# Altium project Q24_ECU_REWORK.PrjPcb (part 1 of 2)
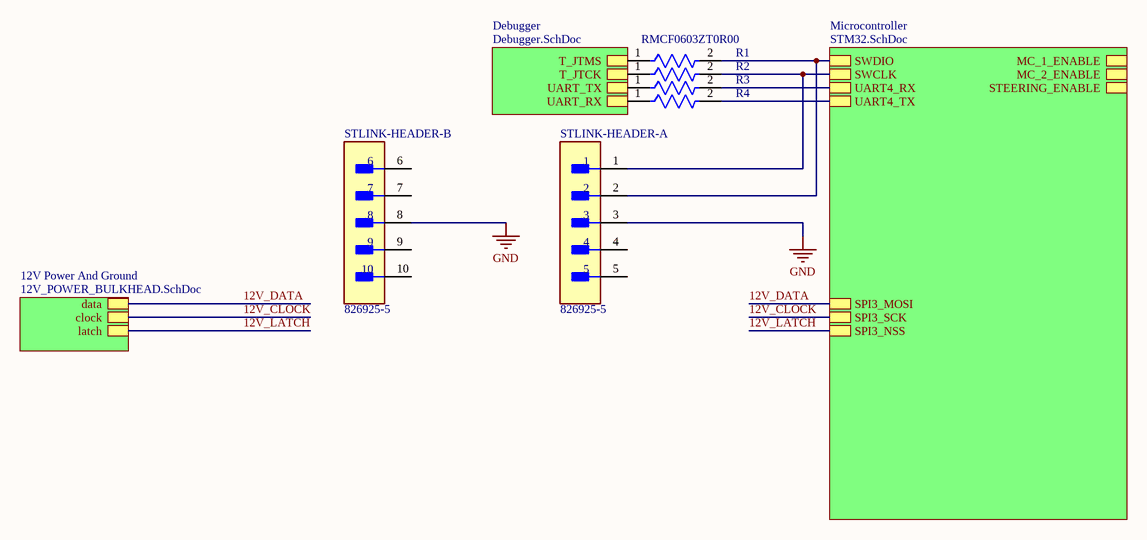
[diagram p0: TOP.SchDoc]
19 sheets, 138 parts. Net scope: hierarchical (ports join the sheet entries above them; power ports are global).
Board file: PCB.PcbDoc
Sheets:
  TOP.SchDoc
    Microcontroller = STM32.SchDoc
      12_TO_3_VOLTAGE_DIVIDER = 12_TO_3V3_VOLTAGE_DIVIDER.SchDoc
      12_TO_3_VOLTAGE_DIVIDER = 12_TO_3V3_VOLTAGE_DIVIDER.SchDoc
      12_TO_3_VOLTAGE_DIVIDER = 12_TO_3V3_VOLTAGE_DIVIDER.SchDoc
      12_TO_3_VOLTAGE_DIVIDER = 12_TO_3V3_VOLTAGE_DIVIDER.SchDoc
      12_TO_3_VOLTAGE_DIVIDER = 12_TO_3V3_VOLTAGE_DIVIDER.SchDoc
      12_TO_3_VOLTAGE_DIVIDER = 12_TO_3V3_VOLTAGE_DIVIDER.SchDoc
    Debugger = Debugger.SchDoc
      MCU = DebuggerMCU.SchDoc
      POWER = Power.SchDoc
      CONNECTORS = DebuggerConnectors.SchDoc
    12V Power And Ground = 12V_POWER_BULKHEAD.SchDoc
      Shift Register = shiftRegister.SchDoc
      Designator = 12V_LS.SchDoc
      Designator = 12V_LS.SchDoc
      Designator = 12V_LS.SchDoc
      Designator = 12V_LS.SchDoc
      Designator = 12V_LS.SchDoc
      Designator = 12V_LS.SchDoc
  Connectors.SchDoc
    Buck = Buck.SchDoc
    LDO = LDO.SchDoc
  CAN.SchDoc
  IMU.SchDoc
  5VBulkhead.SchDoc
    Shift Register = shiftRegister.SchDoc
    5VLS1 = 5V_LS.SchDoc
    5VLS2 = 5V_LS.SchDoc
    5VLS3 = 5V_LS.SchDoc
    5VLS4 = 5V_LS.SchDoc
    5VLS5 = 5V_LS.SchDoc
    5VLS6 = 5V_LS.SchDoc
  5V_TO_3V3_VOLTAGE_DIVIDER.SchDoc
  BOARD_POWER.SchDoc

## Sheet TOP.SchDoc: =DocumentName
size A4; Organization: Queen's Formula SAE; Address1: 130 Stuart St, Kingston; Address2: Ontario; Address3: Canada; Address4: K7L 2V9; DocumentNumber: 1; Revision: 0; SheetNumber: 1; SheetTotal: 1

### Parts
R1  RMCF0603ZT0R00  [FP-RMCF0603-MFG]
R2  RMCF0603ZT0R00  [FP-RMCF0603-MFG]  (value not drawn)
R3  RMCF0603ZT0R00  [FP-RMCF0603-MFG]  (value not drawn)
R4  RMCF0603ZT0R00  [FP-RMCF0603-MFG]  (value not drawn)
STLINK-HEADER-  826925-5  [FP-826925-5-MFG]  (parts A,B of 2)

### Sub-sheets
12V Power And Ground = 12V_POWER_BULKHEAD.SchDoc: data, clock, latch
Debugger = Debugger.SchDoc: T_JTCK, T_JTMS, UART_TX, UART_RX
Microcontroller = STM32.SchDoc: SWDIO, SWCLK, UART4_RX, UART4_TX, SPI3_NSS, SPI3_MOSI, SPI3_SCK, MC_1_ENABLE, MC_2_ENABLE, STEERING_ENABLE

### Nets
GND: STLINK-HEADER-.3 STLINK-HEADER-.8
12V_CLOCK: sheet Microcontroller/SPI3_SCK, sheet 12V Power And Ground/clock
12V_DATA: sheet Microcontroller/SPI3_MOSI, sheet 12V Power And Ground/data
12V_LATCH: sheet Microcontroller/SPI3_NSS, sheet 12V Power And Ground/latch
T_JTCK: R2.1 ; sheet Debugger/T_JTCK
T_JTMS: R1.1 ; sheet Debugger/T_JTMS
UART_RX: R4.1 ; sheet Debugger/UART_RX
UART_TX: R3.1 ; sheet Debugger/UART_TX
NetR1_2: R1.2 STLINK-HEADER-.2 ; sheet Microcontroller/SWDIO
NetR2_2: R2.2 STLINK-HEADER-.1 ; sheet Microcontroller/SWCLK
NetR3_2: R3.2 ; sheet Microcontroller/UART4_RX
NetR4_2: R4.2 ; sheet Microcontroller/UART4_TX

Not connected (* = marked no-connect by the designer): STLINK-HEADER- 4 5 6 7 9 10

### Notes on the sheet
- Title
- Size:
- Date:
- A4
- Number:
- Time:
- Revision:
- Sheet
- of
- File:

### Library data of the parts
R1-R4 = CMP-26527-000011-1: RES 0 OHM JUMPER 1/10W 0603; Manufacturer: Stackpole; Power Rating: 0.1W; Voltage Rating: 75V; Resistance: 0mΩ; Automotive Grade: Grade 0; Value: 0mΩ; Series: RMCF; Manufacturer Part Number: RMCF0603ZT0R00; Device Class L1: Passive Components; Device Class L3: Chip SMD Resistors; Octopart: https://octopart.com/rmcf0603zt0r00-stackpole+electronics-19213618; Temperature: -55°C to +155°C; Lead Free: Yes; ComponentLink2URL: https://www.seielect.com/catalog/sei-rmcf_rmcp.pdf; Height: 0.55mm; Composition: Thick Film; Package: RMCF0603; Automotive: Yes; Temperature Range High: +155°C; Ipc Land Pattern Name: RESC15580X45; Digikey Description: RES 0 OHM JUMPER 1/10W 0603; RoHS: TRUE; ComponentLink2Description: Datasheet; Temperature Range Low: -55°C; Category: Res; Device Class L2: Resistors
STLINK-HEADER- = CMP-03369-000006-1: CONN HEADER VERT 10POS 2.54MM; Manufacturer: TE Connectivity; Conn Orientation: Vertical; Standoff Height: 0.3mm; Number Of Contacts: 10; Current Rating: 5A; Conn Gender: Male; Number Of Rows: 2; Category: Conn; Octopart: https://octopart.com/826925-5-te+connectivity-41836231; Lead Free: Yes; Height: 9.9mm; ComponentLink2Description: Datasheet; Temperature Range High: +105°C; Pitch: 2.54mm; Manufacturer Part Number: 826925-5; Automotive: No; Digikey Description: CONN HEADER VERT 10POS 2.54MM; ComponentLink2URL: https://www.te.com/commerce/DocumentDelivery/DDEController?Action=showdoc&DocId=Customer+Drawing%7F826629%7FAC%7Fpdf%7FEnglish%7FENG_CD_826629_AC.pdf%7F826925-5; Temperature: -65°C to +105°C; RoHS: TRUE; Package: 826925-5; Contact Material: Tin,Nickel; Mouser Description: Headers & Wire Housings 2X05 POS VERT TIN; Device Class L2: Headers and Wire Housings; Device Class L3: unset; Device Class L1: Connectors; Temperature Range Low: -65°C

## Sheet STM32.SchDoc
size A4
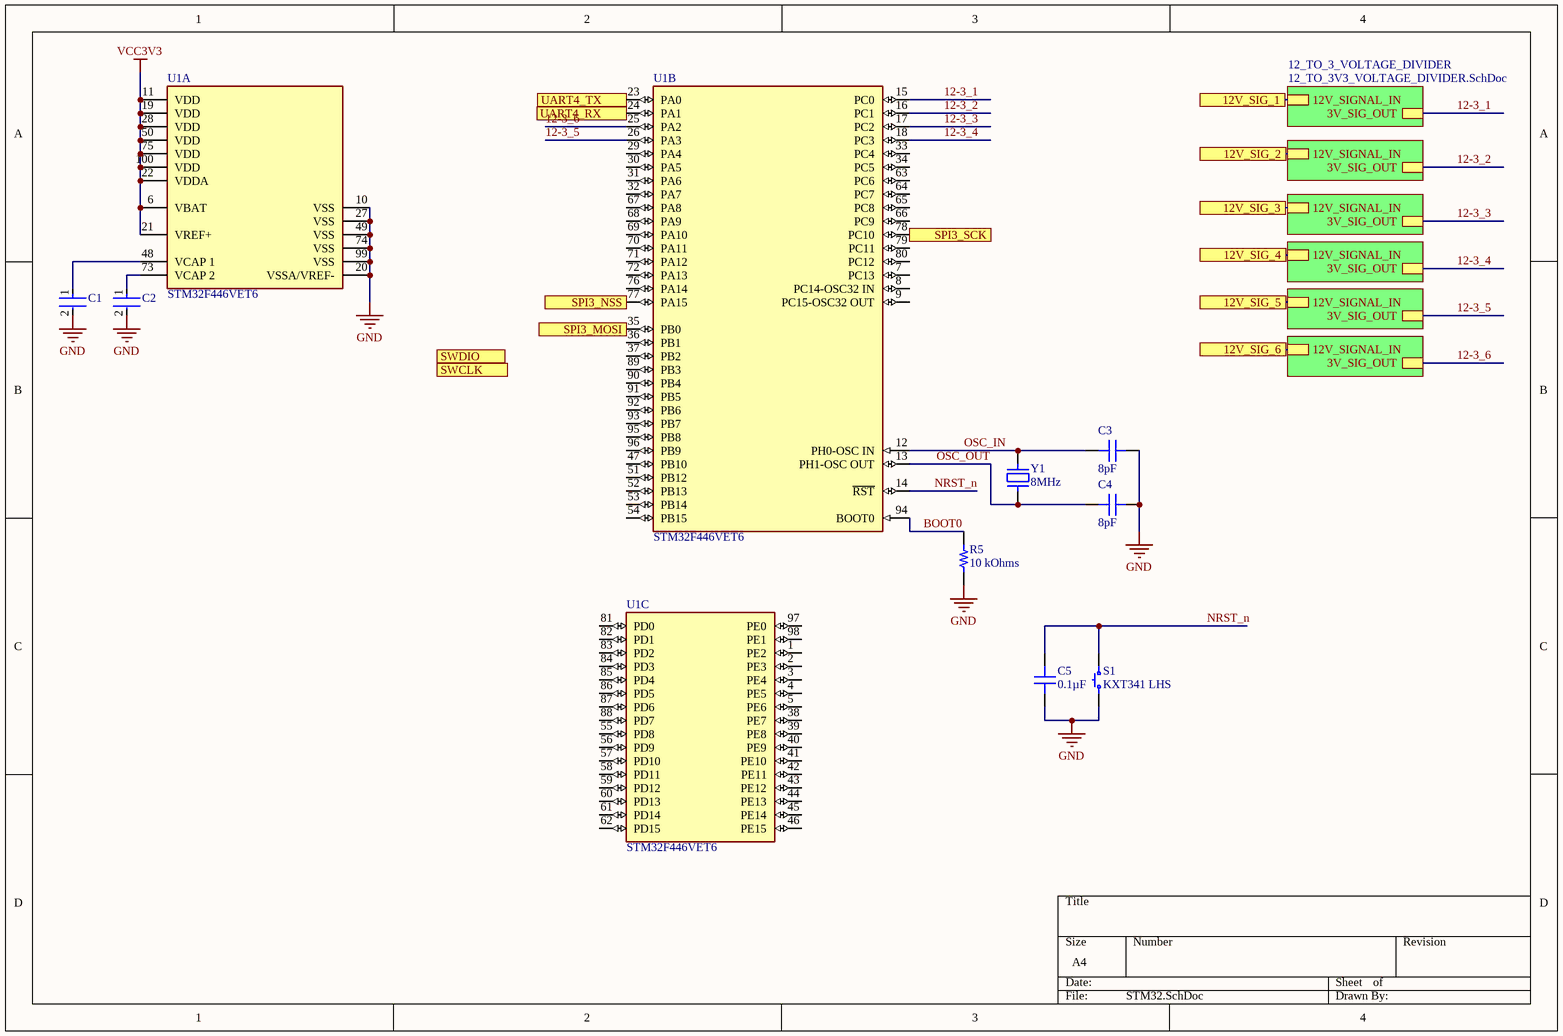
[diagram p1: STM32.SchDoc]

### Parts
C1  GRM188R71A225KE15D  [FP-GRM188-0_1-e0_2_0_5-MFG]  (value not drawn)
C2  GRM188R71A225KE15D  [FP-GRM188-0_1-e0_2_0_5-MFG]  (value not drawn)
C3  8pF  [CAP 0402_1005]
C4  8pF  [CAP 0402_1005]
C5  0.1µF  [CAP 0402_1005]
R5  10 kOhms  [RES 0402_1005]
S1  KXT341 LHS  [C&K KXT3]
U1  STM32F446VET6  [FP-LQFP100-1L-MFG]  (parts A,B,C of 3)
Y1  8MHz  [NDK NX3225GD]

### Sub-sheets
12_TO_3_VOLTAGE_DIVIDER = 12_TO_3V3_VOLTAGE_DIVIDER.SchDoc: 12V_SIGNAL_IN, 3V_SIG_OUT
12_TO_3_VOLTAGE_DIVIDER = 12_TO_3V3_VOLTAGE_DIVIDER.SchDoc: 12V_SIGNAL_IN, 3V_SIG_OUT
12_TO_3_VOLTAGE_DIVIDER = 12_TO_3V3_VOLTAGE_DIVIDER.SchDoc: 12V_SIGNAL_IN, 3V_SIG_OUT
12_TO_3_VOLTAGE_DIVIDER = 12_TO_3V3_VOLTAGE_DIVIDER.SchDoc: 12V_SIGNAL_IN, 3V_SIG_OUT
12_TO_3_VOLTAGE_DIVIDER = 12_TO_3V3_VOLTAGE_DIVIDER.SchDoc: 12V_SIGNAL_IN, 3V_SIG_OUT
12_TO_3_VOLTAGE_DIVIDER = 12_TO_3V3_VOLTAGE_DIVIDER.SchDoc: 12V_SIGNAL_IN, 3V_SIG_OUT

### Ports
12V_SIG_1, 12V_SIG_2, 12V_SIG_3, 12V_SIG_4, 12V_SIG_5, 12V_SIG_6, SPI3_MOSI, SPI3_NSS, SPI3_SCK, SWCLK, SWDIO, UART4_RX, UART4_TX

### Nets
GND: C1.2 C2.2 C3.2 C4.2 C5.1 R5.1 S1.1 U1.10(VSS) U1.20(VSSA/VREF-) U1.27(VSS) U1.49(VSS) U1.74(VSS) U1.99(VSS)
VCC3V3: U1.6(VBAT) U1.11(VDD) U1.19(VDD) U1.21(VREF+) U1.22(VDDA) U1.28(VDD) U1.50(VDD) U1.75(VDD) U1.100(VDD)
12-3_1: U1.15(PC0) ; sheet 12_TO_3_VOLTAGE_DIVIDER/3V_SIG_OUT
12-3_2: U1.16(PC1) ; sheet 12_TO_3_VOLTAGE_DIVIDER/3V_SIG_OUT
12-3_3: U1.17(PC2) ; sheet 12_TO_3_VOLTAGE_DIVIDER/3V_SIG_OUT
12-3_4: U1.18(PC3) ; sheet 12_TO_3_VOLTAGE_DIVIDER/3V_SIG_OUT
12-3_5: U1.26(PA3) ; sheet 12_TO_3_VOLTAGE_DIVIDER/3V_SIG_OUT
12-3_6: U1.25(PA2) ; sheet 12_TO_3_VOLTAGE_DIVIDER/3V_SIG_OUT
12V_CLOCK: U1.78(PC10) ; port SPI3_SCK
12V_DATA: U1.35(PB0) ; port SPI3_MOSI
12V_LATCH: U1.77(PA15) ; port SPI3_NSS
BOOT0: R5.2 U1.94(BOOT0)
NRST_n: C5.2 S1.2 U1.14(~{RST})
OSC_IN: C3.1 U1.12(PH0-OSC_IN) Y1.2
OSC_OUT: C4.1 U1.13(PH1-OSC_OUT) Y1.1
NetC1_1: C1.1 U1.48(VCAP_1)
NetC2_1: C2.1 U1.73(VCAP_2)
NetR3_2: U1.24(PA1) ; port UART4_RX
NetR4_2: U1.23(PA0) ; port UART4_TX
NetR24_Microcontroller_12_TO_3_VOLTAGE_DIVIDER#1_2: port 12V_SIG_1, sheet 12_TO_3_VOLTAGE_DIVIDER/12V_SIGNAL_IN
NetR24_Microcontroller_12_TO_3_VOLTAGE_DIVIDER#2_2: port 12V_SIG_2, sheet 12_TO_3_VOLTAGE_DIVIDER/12V_SIGNAL_IN
NetR24_Microcontroller_12_TO_3_VOLTAGE_DIVIDER#3_2: port 12V_SIG_3, sheet 12_TO_3_VOLTAGE_DIVIDER/12V_SIGNAL_IN
NetR24_Microcontroller_12_TO_3_VOLTAGE_DIVIDER#4_2: port 12V_SIG_4, sheet 12_TO_3_VOLTAGE_DIVIDER/12V_SIGNAL_IN
NetR24_Microcontroller_12_TO_3_VOLTAGE_DIVIDER#5_2: port 12V_SIG_5, sheet 12_TO_3_VOLTAGE_DIVIDER/12V_SIGNAL_IN
NetR24_Microcontroller_12_TO_3_VOLTAGE_DIVIDER#6_2: port 12V_SIG_6, sheet 12_TO_3_VOLTAGE_DIVIDER/12V_SIGNAL_IN

Not connected (* = marked no-connect by the designer): U1 1(PE2) 2(PE3) 3(PE4) 4(PE5) 5(PE6) 7(PC13) 8(PC14-OSC32_IN) 9(PC15-OSC32_OUT) 29(PA4) 30(PA5) 31(PA6) 32(PA7) 33(PC4) 34(PC5) 36(PB1) 37(PB2) 38(PE7) 39(PE8) 40(PE9) 41(PE10) 42(PE11) 43(PE12) 44(PE13) 45(PE14) 46(PE15) 47(PB10) 51(PB12) 52(PB13) 53(PB14) 54(PB15) 55(PD8) 56(PD9) 57(PD10) 58(PD11) 59(PD12) 60(PD13) 61(PD14) 62(PD15) 63(PC6) 64(PC7) 65(PC8) 66(PC9) 67(PA8) 68(PA9) 69(PA10) 70(PA11) 71(PA12) 72(PA13) 76(PA14) 79(PC11) 80(PC12) 81(PD0) 82(PD1) 83(PD2) 84(PD3) 85(PD4) 86(PD5) 87(PD6) 88(PD7) 89(PB3) 90(PB4) 91(PB5) 92(PB6) 93(PB7) 95(PB8) 96(PB9) 97(PE0) 98(PE1)

### Library data of the parts
C1 C2 = CMP-2006-02836-2: Chip Multilayer Ceramic Capacitors for General Purpose, 0603, 2.2uF, X7R, 15%, 10%, 10V; Case Code (Metric): 1608; Height: 0.8mm; Packaging: Cut Tape; Voltage: 10V; Lead Free: Lead Free; Min Operating Temperature: -55°C; Voltage Rating (DC): 10V; Max Operating Temperature: 125°C; Voltage Rating: 10V; Dielectric: X7R; Depth: 0.8mm; Case Code (Imperial): 0603; Termination: SMD/SMT; Case/Package: 0603; Number of Pins: 2; REACH SVHC: No SVHC; Mount: Surface Mount; Width: 0.031inch; Material: Ceramic; Capacitance: 2.2uF; Package Quantity: 1; Weight: 7.1E-05oz; Length: 1.6mm; Thickness: 0.035inch; Tolerance: 10%
C3 C4 = C1005NP01H080D050BA: CAP CER 8PF 50V NP0 0402; Manufacturer: TDK Corporation; Temperature Coefficient: C0G, NP0; Tolerance: ±0.5pF; Part Number: C1005NP01H080D050BA; Value: 8pF; Applications: General Purpose; Capacitance: 8pF; ComponentLink1Description: Datasheet; ComponentLink1URL: https://product.tdk.com/info/en/catalog/datasheets/mlcc_commercial_hightemp_en.pdf?ref_disty=digikey; ComponentLink2Description: DigiKey Link; ComponentLink2URL: http://digikey.com/product-detail/en/tdk-corporation/C1005NP01H080D050BA/445-13781-1-ND/3955447; Device Package: 0402 (1005 Metric); Features: High Temperature; LastUpdated: 2020-09-02 1:02:24 AM; Lifecycle Status: Active; Minimum Order: 1; Mounting Type: Surface Mount, MLCC; Operating Temperature: -55°C ~ 150°C; Package / Case: 0402 (1005 Metric); Packaging: TapeAndReel; PartId: 2033; Part Status: Active; Price: 0.01; Series: C; Size / Dimension: 0.039" L x 0.020" W (1.00mm x 0.50mm); Supplier 1: DigiKey; Supplier Part Number 1: 445-13781-1-ND; Thickness (Max): 0.022" (0.55mm); Voltage - Rated: 50V
C5 = C0402C104K4RECAUTO: CAP CER 0402 0.1UF 16V X7R 10%; Manufacturer: KEMET; Part Number: C0402C104K4RECAUTO; Value: 0.1µF; Applications: Automotive, ESD Protection; Capacitance: 0.1µF; ComponentLink1Description: Datasheet; ComponentLink1URL: https://api.kemet.com/component-edge/download/datasheet/C0402C104K4RECAUTO.pdf; ComponentLink2Description: DigiKey Link; ComponentLink2URL: http://digikey.com/product-detail/en/kemet/C0402C104K4RECAUTO/399-17167-1-ND/8563708; Device Package: 0402 (1005 Metric); LastUpdated: 2020-09-02 1:02:25 AM; Lifecycle Status: Active; Minimum Order: 1; Mounting Type: Surface Mount, MLCC; Operating Temperature: -55°C ~ 125°C; Package / Case: 0402 (1005 Metric); Packaging: TapeAndReel; PartId: 1731; Part Status: Active; Price: 0.02; Series: ESD SMD Auto X7R; Size / Dimension: 0.039" L x 0.020" W (1.00mm x 0.50mm); Supplier 1: DigiKey; Supplier Part Number 1: 399-17167-1-ND; Temperature Coefficient: X7R; Thickness (Max): 0.022" (0.55mm); Tolerance: ±10%; Voltage - Rated: 16V; Ratings: AEC-Q200
R5 = CRCW040210K0DHEDP: RES SMD 10K OHM 0.5% 1/16W 0402; Manufacturer: Vishay Dale; Power (Watts): 0.063W, 1/16W; Temperature Coefficient: ±50ppm/°C; Part Number: CRCW040210K0DHEDP; Value: 10 kOhms; ComponentLink1Description: Datasheet; ComponentLink1URL: http://www.vishay.com/docs/20036/dcrcwpe3.pdf; ComponentLink2Description: DigiKey Link; ComponentLink2URL: http://digikey.com/product-detail/en/vishay-dale/CRCW040210K0DHEDP/541-10KAVCT-ND/3593906; Composition: Thick Film; Device Package: 0402 (1005 Metric); Height - Seated (Max): 0.016" (0.40mm); LastUpdated: 2020-09-02 1:08:05 AM; Lifecycle Status: Active; Minimum Order: 1; Number of Terminations: 2; Operating Temperature: -55°C ~ 155°C; Package / Case: 0402 (1005 Metric); Packaging: TapeAndReel; PartId: 5057; Part Status: Active; Price: 0.03; Resistance: 10 kOhms; Series: CRCW-P; Size / Dimension: 0.039" L x 0.020" W (1.00mm x 0.50mm); Supplier 1: DigiKey; Supplier Part Number 1: 541-10KAVCT-ND; Supplier Device Package: 0402; Tolerance: ±0.5%; Features: Automotive AEC-Q200; Ratings: AEC-Q200
S1 = KXT341 LHS: SWITCH TACTILE SPST-NO 0.02A 15V; Manufacturer: C&K; Actuator Height off PCB, Vertical: 0.60mm; Actuator Orientation: Top Actuated; Actuator Type: Standard; Contact Rating @ Voltage: 0.02A @ 15VDC; Illumination: Non-Illuminated; Operating Force: 330gf; Outline: 3.00mm x 2.00mm; Switch Function: Off-Mom; Part Number: KXT341 LHS; Circuit: SPST-NO; ComponentLink1Description: Datasheet; ComponentLink1URL: https://dznh3ojzb2azq.cloudfront.net/products/Tactile/KXT3/documents/datasheet.pdf; ComponentLink2Description: DigiKey Link; ComponentLink2URL: http://digikey.com/product-detail/en/c-k/KXT341-LHS/CKN10781CT-ND/6607324; LastUpdated: 2020-09-02 1:27:07 AM; Lifecycle Status: Active; Minimum Order: 1; Mounting Type: Surface Mount; Operating Temperature: -40°C ~ 85°C; Packaging: TapeAndReel; Part Status: Active; Price: 0.14; Series: KXT3; Supplier 1: DigiKey; Supplier Part Number 1: CKN10781CT-ND; Termination Style: SMD (SMT) Tab
U1 = CMP-12105-000075-1: IC MCU 32BIT 512KB FLASH 100LQFP; Manufacturer: STMicroelectronics; Ram Size: 128KBytes; Data Bus Width: 32bits; Max Junction Temp: +125°C; Number Of Adc Channels: 16; Max Supply Voltage: 3.6V; Nominal Supply Current: 1.4-86mA; Number Of Uart Channels: 6; Core Architecture: ARM Cortex-M4; Standoff Height: 0.05mm; Number Of A/D Converters: 3; Frequency: 180MHz; Number Of Cores: 1; Min Supply Voltage: 1.65V; Number Of Timers/Counters: 14; Number Of Usb Channels: 2; Number Of Spi Channels: 4; Interface: I2C,SPI,UART,USART,Parallel,CAN,USB,LIN,IrDA,I2S,Other; Memory Size: 512KBytes; Number Of I/Os: 81; Ambient Temperature Range High: +85°C; Mouser Description: ARM Microcontrollers - MCU High-performance and DSP with FPU, ARM Cortex-M4 MCU with 512 Kbytes Flash, 180 MHz CPU, Art Accelerator, SDRAM; Device Class L2: Embedded Processors and Controllers; Temperature Range Low: -40°C; Device Class L1: Integrated Circuits (ICs); RoHS: TRUE; Ipc Land Pattern Name: QFP50P1600X1600X160-100; Manufacturer Part Number: STM32F446VET6; Octopart: https://octopart.com/stm32f446vet6-stmicroelectronics-52642922; Package: LQFP100-1L; Automotive: No; Category: IC; ComponentLink2URL: https://www.st.com/resource/en/datasheet/stm32f446ve.pdf; Digikey Description: IC MCU 32BIT 512KB FLASH 100LQFP; Temperature Range High: +85°C; Memory Type: FLASH; Lead Free: Yes; Height: 1.6mm; ComponentLink2Description: Datasheet; Number Of I2C Channels: 4; Device Class L3: Microcontrollers; Temperature: -40°C to +85°C; Ambient Temperature Range Low: -40°C
Y1 = NX3225GD-8MHZ-STD-CRA-3: CRYSTAL 8.0000MHZ 8PF SMD; Manufacturer: NDK America, Inc.; ESR (Equivalent Series Resistance): 500 Ohms; Frequency Stability: ±150ppm; Frequency Tolerance: ±50ppm; Operating Mode: Fundamental; Part Number: NX3225GD-8MHZ-STD-CRA-3; ComponentLink1Description: Datasheet; ComponentLink1URL: http://www.ndk.com/images/products/catalog/c_NX3225GD-STD-CRA-3_e.pdf; ComponentLink2Description: DigiKey Link; ComponentLink2URL: http://digikey.com/product-detail/en/ndk-america-inc/NX3225GD-8MHZ-STD-CRA-3/644-1178-1-ND/3125567; Frequency: 8MHz; Height - Seated (Max): 0.039" (1.00mm); LastUpdated: 2020-09-02 1:25:56 AM; Lifecycle Status: Active; Load Capacitance: 8pF; Minimum Order: 1; Mounting Type: Surface Mount; Operating Temperature: -40°C ~ 150°C; Package / Case: 2-SMD, No Lead; Packaging: TapeAndReel; PartId: 744; Part Status: Active; Price: 0.48; Ratings: AEC-Q200; Series: NX3225GD; Size / Dimension: 0.126" L x 0.098" W (3.20mm x 2.50mm); Supplier 1: DigiKey; Supplier Part Number 1: 644-1178-1-ND; Type: MHz Crystal; Value: 8MHz

## Sheet 12_TO_3V3_VOLTAGE_DIVIDER.SchDoc
size A4
Used 6 times, as channels Microcontroller/12_TO_3_VOLTAGE_DIVIDER, Microcontroller/12_TO_3_VOLTAGE_DIVIDER, Microcontroller/12_TO_3_VOLTAGE_DIVIDER, Microcontroller/12_TO_3_VOLTAGE_DIVIDER, Microcontroller/12_TO_3_VOLTAGE_DIVIDER, Microcontroller/12_TO_3_VOLTAGE_DIVIDER. Parts and nets are listed once, with the designators drawn on the sheet.
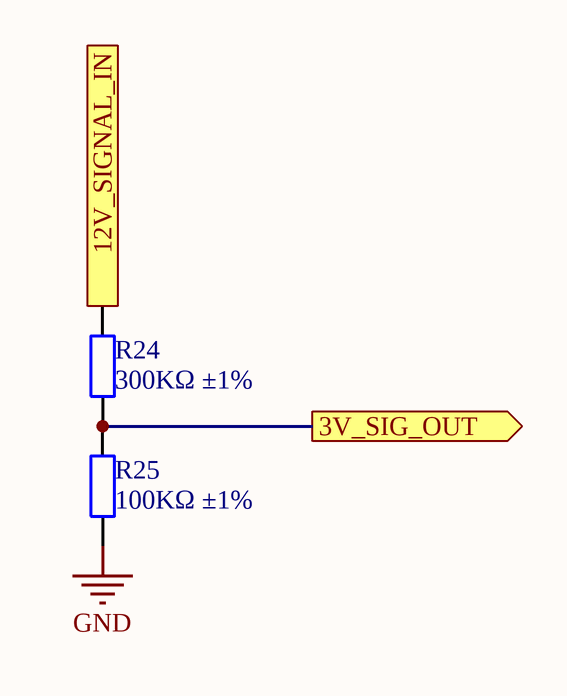
[diagram p2: 12_TO_3V3_VOLTAGE_DIVIDER.SchDoc]

### Parts
R24  300KΩ ±1%  [0402_R]
R25  100KΩ ±1%  [0402_R]

### Ports
3V_SIG_OUT (out), 12V_SIGNAL_IN

### Nets
GND: R25.1
3V_SIG_OUT: R24.1 R25.2 ; port 3V_SIG_OUT
12V_SIGNAL_IN: R24.2 ; port 12V_SIGNAL_IN

### Channels
Microcontroller/12_TO_3_VOLTAGE_DIVIDER: designators end in _Microcontroller_12_TO_3_VOLTAGE_DIVIDER#1; ports 3V_SIG_OUT=12-3_1 12V_SIGNAL_IN=NetR24_Microcontroller_12_TO_3_VOLTAGE_DIVIDER#1_2
Microcontroller/12_TO_3_VOLTAGE_DIVIDER: designators end in _Microcontroller_12_TO_3_VOLTAGE_DIVIDER#2; ports 3V_SIG_OUT=12-3_2 12V_SIGNAL_IN=NetR24_Microcontroller_12_TO_3_VOLTAGE_DIVIDER#2_2
Microcontroller/12_TO_3_VOLTAGE_DIVIDER: designators end in _Microcontroller_12_TO_3_VOLTAGE_DIVIDER#3; ports 3V_SIG_OUT=12-3_3 12V_SIGNAL_IN=NetR24_Microcontroller_12_TO_3_VOLTAGE_DIVIDER#3_2
Microcontroller/12_TO_3_VOLTAGE_DIVIDER: designators end in _Microcontroller_12_TO_3_VOLTAGE_DIVIDER#4; ports 3V_SIG_OUT=12-3_4 12V_SIGNAL_IN=NetR24_Microcontroller_12_TO_3_VOLTAGE_DIVIDER#4_2
Microcontroller/12_TO_3_VOLTAGE_DIVIDER: designators end in _Microcontroller_12_TO_3_VOLTAGE_DIVIDER#5; ports 3V_SIG_OUT=12-3_5 12V_SIGNAL_IN=NetR24_Microcontroller_12_TO_3_VOLTAGE_DIVIDER#5_2
Microcontroller/12_TO_3_VOLTAGE_DIVIDER: designators end in _Microcontroller_12_TO_3_VOLTAGE_DIVIDER#6; ports 3V_SIG_OUT=12-3_6 12V_SIGNAL_IN=NetR24_Microcontroller_12_TO_3_VOLTAGE_DIVIDER#6_2

### Library data of the parts
R24 = 0402 300K (3003) 1%: Chip resistor; Manufacturer: Uniroyal Elec; PartNumber: 0402WGF3003TCE; Power: 1/16W; ComponentLink1Description: Supplier link; ComponentLink1URL: http://www.szlcsc.com/product/details_26517.html; Package: 0402; Supplier: LC; SuppliersPartNumber: C25774; Resistance: 300KΩ; Tolerance: 1%
R25 = 0402 100K (1003) 1%: Chip resistor; Manufacturer: Uniroyal Elec; PartNumber: 0402WGF1003TCE; Power: 1/16W; ComponentLink1Description: Supplier link; ComponentLink1URL: http://www.szlcsc.com/product/details_26484.html; Package: 0402; Supplier: LC; SuppliersPartNumber: C25741; Resistance: 100KΩ; Tolerance: 1%

## Sheet Debugger.SchDoc
size A4
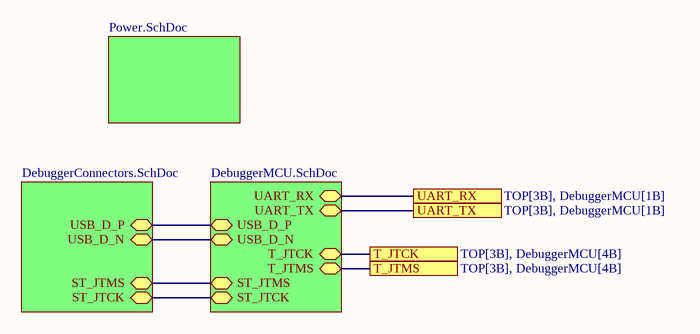
[diagram p3: Debugger.SchDoc]

### Sub-sheets
CONNECTORS = DebuggerConnectors.SchDoc: USB_D_P (bidir), USB_D_N (bidir), ST_JTMS (bidir), ST_JTCK (bidir)
MCU = DebuggerMCU.SchDoc: UART_RX (bidir), UART_TX (bidir), USB_D_P (bidir), USB_D_N (bidir), T_JTCK (bidir), T_JTMS (bidir), ST_JTMS (bidir), ST_JTCK (bidir)
POWER = Power.SchDoc: no entries

### Ports
T_JTCK (see TOP[3B], DebuggerMCU[4B]), T_JTMS (see TOP[3B], DebuggerMCU[4B]), UART_RX (see TOP[3B], DebuggerMCU[1B]), UART_TX (see TOP[3B], DebuggerMCU[1B])

### Nets
ST_JTCK: sheet MCU/ST_JTCK, sheet CONNECTORS/ST_JTCK
ST_JTMS: sheet MCU/ST_JTMS, sheet CONNECTORS/ST_JTMS
T_JTCK: port T_JTCK, sheet MCU/T_JTCK
T_JTMS: port T_JTMS, sheet MCU/T_JTMS
UART_RX: port UART_RX, sheet MCU/UART_RX
UART_TX: port UART_TX, sheet MCU/UART_TX
USB_D_N: sheet MCU/USB_D_N, sheet CONNECTORS/USB_D_N
USB_D_P: sheet MCU/USB_D_P, sheet CONNECTORS/USB_D_P

## Sheet DebuggerMCU.SchDoc
size A4
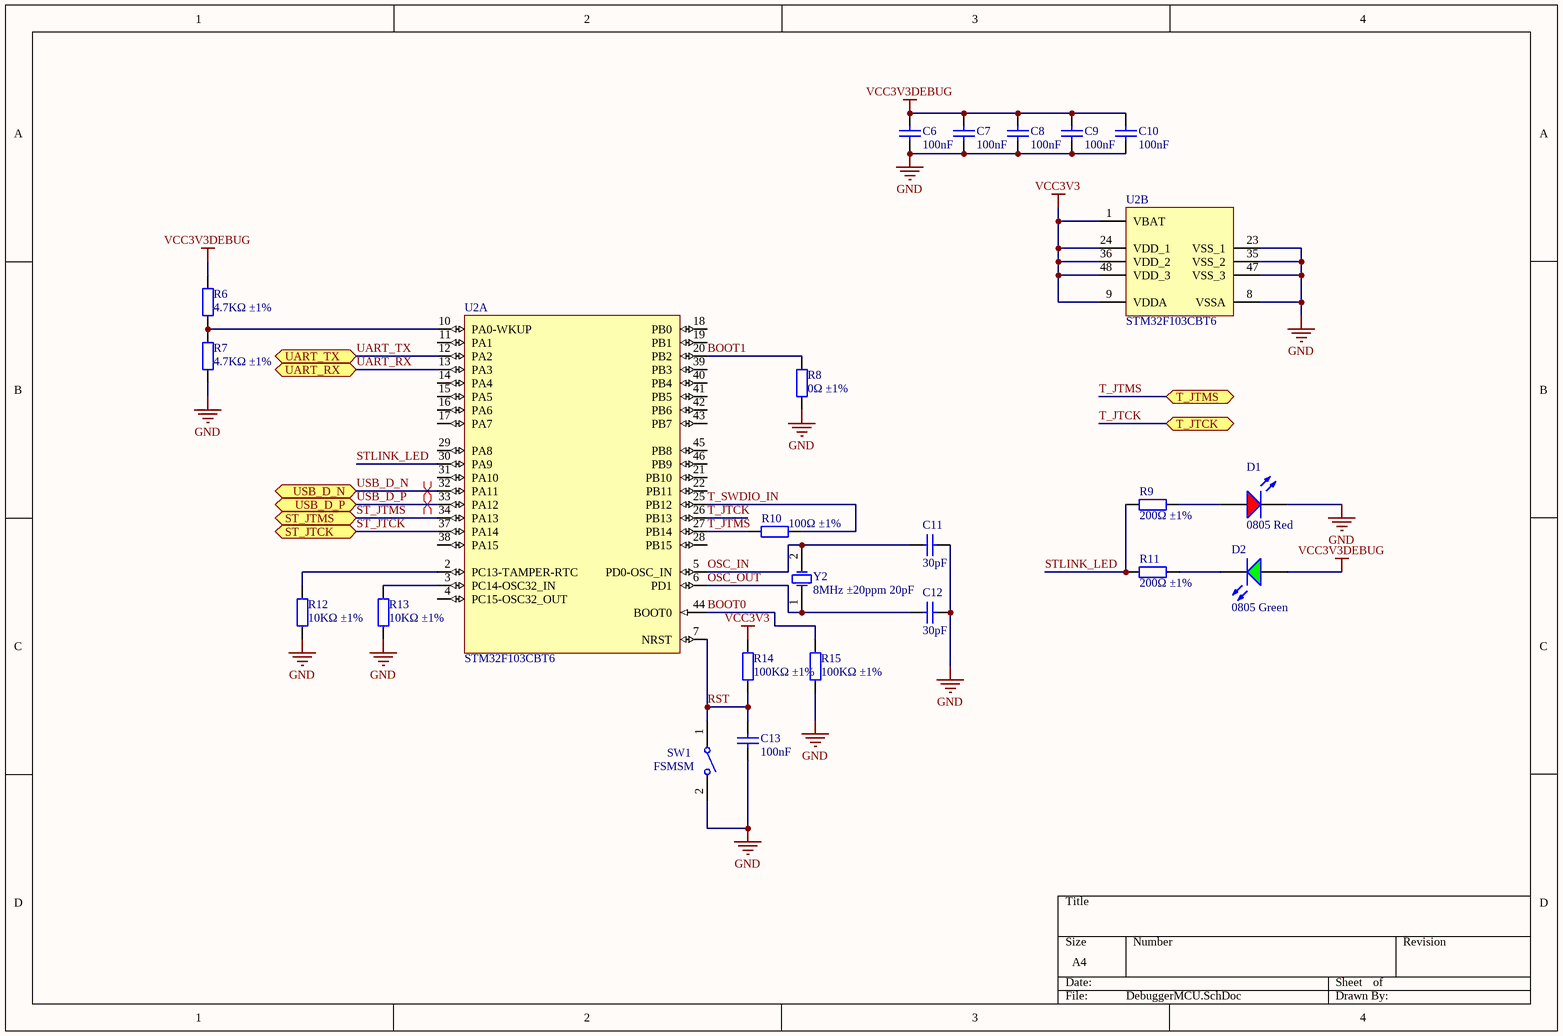
[diagram p4: DebuggerMCU.SchDoc]

### Parts
C6  100nF  [0402_C]
C7  100nF  [0402_C]
C8  100nF  [0402_C]
C9  100nF  [0402_C]
C10  100nF  [0402_C]
C11  30pF  [0402_C]
C12  30pF  [0402_C]
C13  100nF  [0402_C]
D1  0805 Red  [0805_LED_S1]
D2  0805 Green  [0805_LED_S1]
R6  4.7KΩ ±1%  [0805_R]
R7  4.7KΩ ±1%  [0805_R]
R8  0Ω ±1%  [0402_R]
R9  200Ω ±1%  [0402_R]
R10  100Ω ±1%  [0402_R]
R11  200Ω ±1%  [0402_R]
R12  10KΩ ±1%  [0402_R]
R13  10KΩ ±1%  [0402_R]
R14  100KΩ ±1%  [0402_R]
R15  100KΩ ±1%  [0402_R]
SW1  FSMSM  [TECO-FSMSM-2_V]
U2  STM32F103CBT6  [LQFP-48_7x7x05P]  (parts A,B of 2)
Y2  8MHz ±20ppm 20pF  [SMD-5032_2P]

### Ports
ST_JTCK (bidir), ST_JTMS (bidir), T_JTCK (bidir), T_JTMS (bidir), UART_RX (bidir), UART_TX (bidir), USB_D_N (bidir), USB_D_P (bidir)

### Nets
GND: C6.1 C7.1 C8.1 C9.1 C10.1 C11.2 C12.2 C13.1 D1.K R7.1 R8.1 R12.1 R13.1 R15.1 SW1.2 U2.8(VSSA) U2.23(VSS_1) U2.35(VSS_2) U2.47(VSS_3)
VCC3V3: R14.2 U2.1(VBAT) U2.9(VDDA) U2.24(VDD_1) U2.36(VDD_2) U2.48(VDD_3)
VCC3V3DEBUG: C6.2 C7.2 C8.2 C9.2 C10.2 D2.A R6.2
BOOT0: R15.2 U2.44(BOOT0)
BOOT1: R8.2 U2.20(PB2)
OSC_IN: C11.1 U2.5(PD0-OSC_IN) Y2.2(OSC2)
OSC_OUT: C12.1 U2.6(PD1) Y2.1(OSC1)
RST: C13.2 R14.1 SW1.1 U2.7(NRST)
ST_JTCK: U2.37(PA14) ; port ST_JTCK
ST_JTMS: U2.34(PA13) ; port ST_JTMS
STLINK_LED: R9.1 R11.1 U2.30(PA9)
T_JTCK: U2.26(PB13) ; port T_JTCK
T_JTMS: R10.2 U2.27(PB14) ; port T_JTMS
T_SWDIO_IN: R10.1 U2.25(PB12)
UART_RX: U2.13(PA3) ; port UART_RX
UART_TX: U2.12(PA2) ; port UART_TX
USB_D_N: U2.32(PA11) ; port USB_D_N
USB_D_P: U2.33(PA12) ; port USB_D_P
NetD1_A: D1.A R9.2
NetD2_K: D2.K R11.2
NetR6_1: R6.1 R7.2 U2.10(PA0-WKUP)
NetR12_2: R12.2 U2.2(PC13-TAMPER-RTC)
NetR13_2: R13.2 U2.3(PC14-OSC32_IN)

Not connected (* = marked no-connect by the designer): U2 4(PC15-OSC32_OUT) 11(PA1) 14(PA4) 15(PA5) 16(PA6) 17(PA7) 18(PB0) 19(PB1) 21(PB10) 22(PB11) 28(PB15) 29(PA8) 31(PA10) 38(PA15) 39(PB3) 40(PB4) 41(PB5) 42(PB6) 43(PB7) 45(PB8) 46(PB9)

### Layout directives
differential pair: USB_D_N, USB_D_P

### Library data of the parts
C6-C10 C13 = 0402 100nF (104) 10% 16V: Chip capacitors; Manufacturer: Samsung Electro-Mechanics; PartNumber: CL05B104KO5NNNC; Tolerance: 10%; Voltage: 16V; ComponentLink1Description: Supplier link; ComponentLink1URL: http://www.szlcsc.com/product/details_1877.html; Package: 0402; Supplier: LC; SuppliersPartNumber: C1525; Capacitance: 100nF
C11 C12 = 0402 30pF (300) 5% 50V: Chip capacitors; Manufacturer: Guangdong Fenghua Advanced Tech; PartNumber: 0402CG300J500NT; Tolerance: 5%; Voltage: 50V; ComponentLink1Description: Supplier link; ComponentLink1URL: http://www.szlcsc.com/product/details_1922.html; Package: 0402; Supplier: LC; SuppliersPartNumber: C1570; Capacitance: 30pF
D1 = 0805 LED Red: LED; ComponentLink1Description: 供应商链接; ComponentLink1URL: http://www.szlcsc.com/product/details_2668.html; Package: 0805; Supplier: LC; SuppliersPartNumber: C2295; Color: Red
D2 = 0805 LED Green: LED; ComponentLink1Description: 供应商链接; ComponentLink1URL: http://www.szlcsc.com/product/details_2670.html; Package: 0805; Supplier: LC; SuppliersPartNumber: C2297; Color: Green
R6 R7 = 0805 4.7K (4701) 1%: Chip resistor; Manufacturer: Uniroyal Elec; Power: 1/8W; ComponentLink1Description: Supplier link; ComponentLink1URL: http://www.szlcsc.com/product/details_18361.html; Package: 0805; Supplier: LC; SuppliersPartNumber: C17673; Tolerance: 1%
R8 = 0402 0R (0R0) 1%: Chip resistor; Manufacturer: Uniroyal Elec; PartNumber: 0402WGF0000TCE; Power: 1/16W; ComponentLink1Description: Supplier link; ComponentLink1URL: http://www.szlcsc.com/product/details_17853.html; Package: 0402; Supplier: LC; SuppliersPartNumber: C17168; Resistance: 0Ω; Tolerance: 1%
R9 R11 = 0402 200R (2000) 1%: Chip resistor; Manufacturer: Uniroyal Elec; PartNumber: 0402WGF2000TCE; Power: 1/16W; ComponentLink1Description: Supplier link; ComponentLink1URL: http://www.szlcsc.com/product/details_25830.html; Package: 0402; Supplier: LC; SuppliersPartNumber: C25087; Resistance: 200Ω; Tolerance: 1%
R10 = 0402 100R (1000) 1%: Chip resistor; Manufacturer: Uniroyal Elec; PartNumber: 0402WGF1000TCE; Power: 1/16W; ComponentLink1Description: Supplier link; ComponentLink1URL: http://www.szlcsc.com/product/details_25819.html; Package: 0402; Supplier: LC; SuppliersPartNumber: C25076; Resistance: 100Ω; Tolerance: 1%
R12 R13 = 0402 10K (1002) 1%: Chip resistor; Manufacturer: Uniroyal Elec; PartNumber: 0402WGF1002TCE; Power: 1/16W; ComponentLink1Description: Supplier link; ComponentLink1URL: http://www.szlcsc.com/product/details_26487.html; Package: 0402; Supplier: LC; SuppliersPartNumber: C25744; Resistance: 10KΩ; Tolerance: 1%
R14 R15 = 0402 100K (1003) 1%: as R25 on sheet 12_TO_3V3_VOLTAGE_DIVIDER; ComponentLink1Description: Supplier link; ComponentLink1URL: http://www.szlcsc.com/product/details_26484.html; Package: 0402; Supplier: LC; SuppliersPartNumber: C25741; Resistance: 100KΩ; Tolerance: 1%
SW1 = CMP-2000-07511-1: FSMSM Push Button Switch, 50 mA, -35 to 85 degC, 2-Pin SMD, RoHS, Bulk; Manufacturer: TE Connectivity; Actuator Length: 1.07mm; Electrical Life: 20000Cycles; Actuator Material: Polyamide; Current Rating: 50mA; Illumination Type: Illuminated; Voltage Rating (DC): 24V; Contact Resistance: 100mOhm; Case\/Package: SMD/SMT; Operating Force: 180gf; Switch Travel: 0.25mm; Max Voltage Rating (DC): 12V; Throw Configuration: SPST; Packaging: LoosePiece; Max Operating Temperature: 85degC; ELV: Compliant; Package Description: 2-Pin Surface Mount Device, Body 6 x 3.5 mm, Pitch 9.19 mm; RoHSCompliant: true; Manufacturer URL: http://www.te.com/; Contact Plating: Silver; Contact Material: Brass; Mounting Technology: SurfaceMount; Contact Current Rating: 50mA; Datasheet Version: Rev. C2, 08/2014; Datasheet URL: http://www.te.com/commerce/DocumentDelivery/DDEController?Action=showdoc&DocId=Customer+Drawing%7F1437566-3%7FC2%7Fpdf%7FEnglish%7FENG_CD_1437566-3_C2_1437566_3_1_c.dwg.pdf%7F1437566-3; Mechanical Life: 20000Cycles; Package Reference: FSMSM; REACH SVHC: Unknown; Orientation: Straight; Min Operating Temperature: -35degC; Lead Free: LeadFree; Termination: GullWing; Package Quantity: 1000; Mount: SurfaceMount
U2 = STM32F103CBT6: ARM; ComponentLink1Description: 供应商链接; ComponentLink1URL: http://www.szlcsc.com/product/details_8796.html; Package: LQFP-48_7x7x05P; Supplier: LC; SuppliersPartNumber: C8304
Y2 = SMD-5032_2P 8MHz 20ppm 20pF: 贴片晶振; ComponentLink1Description: 供应商链接; ComponentLink1URL: http://www.szlcsc.com/product/details_117214.html; Package: SMD-5032_2P; Supplier: LC; SuppliersPartNumber: C115962

## Sheet Power.SchDoc
size A4
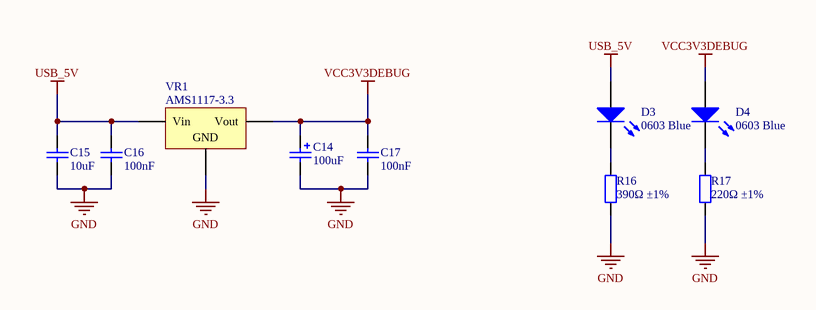
[diagram p5: Power.SchDoc]

### Parts
C14  100uF  [CASE-B_3528]
C15  10uF  [1206_C]
C16  100nF  [0402_C]
C17  100nF  [1206_C]
D3  0603 Blue  [0603_LED_S1]
D4  0603 Blue  [0603_LED_S1]
R16  390Ω ±1%  [0603_R]
R17  220Ω ±1%  [0402_R]
VR1  AMS1117-3.3  [SOT-223]

### Nets
GND: C14.2 C15.1 C16.1 C17.1 R16.1 R17.1 VR1.1(GND)
USB_5V: C15.2 C16.2 D3.A VR1.3(Vin)
VCC3V3DEBUG: C14.1 C17.2 D4.A VR1.2(Vout)
NetD3_K: D3.K R16.2
NetD4_K: D4.K R17.2

### Library data of the parts
C14 = 3528 100uF (107) 10% 6.3V: Tantalum capacitor; Manufacturer: AVX; PartNumber: TAJB107K006RNJ; Tolerance: 10%; Voltage: 6.3V; ComponentLink1Description: Supplier link; ComponentLink1URL: http://www.szlcsc.com/product/details_16815.html; Package: 3528; Supplier: LC; SuppliersPartNumber: C16133; Capacitance: 100uF
C15 = 1206 10uF (106) 10% 50V: Chip capacitors; Manufacturer: Samsung Electro-Mechanics; PartNumber: CL31A106KBHNNNE; Tolerance: 10%; Voltage: 50V; ComponentLink1Description: Supplier link; ComponentLink1URL: http://www.szlcsc.com/product/details_14236.html; Package: 1206; Supplier: LC; SuppliersPartNumber: C13585; Capacitance: 10uF
C16 = 0402 100nF (104) 10% 16V: as C6 on sheet DebuggerMCU; ComponentLink1Description: Supplier link; ComponentLink1URL: http://www.szlcsc.com/product/details_1877.html; Package: 0402; Supplier: LC; SuppliersPartNumber: C1525; Capacitance: 100nF
C17 = 1206 100nF (104) 10% 50V: Chip capacitors; Manufacturer: Samsung Electro-Mechanics; PartNumber: CL31B104KBCNNNC; Tolerance: 10%; Voltage: 50V; ComponentLink1Description: Supplier link; ComponentLink1URL: http://www.szlcsc.com/product/details_25237.html; Package: 1206; Supplier: LC; SuppliersPartNumber: C24497; Capacitance: 100nF
D3 D4 = 0603 LED Blue: LED; ComponentLink1Description: 供应商链接; ComponentLink1URL: http://www.szlcsc.com/product/details_73150.html; Package: 0603; Supplier: LC; SuppliersPartNumber: C72041; Color: Blue
R16 = 0603 390R (3900) 1%: Chip resistor; Manufacturer: Uniroyal Elec; PartNumber: 0603WAF3900T5E; Power: 1/10W; ComponentLink1Description: Supplier link; ComponentLink1URL: http://www.szlcsc.com/product/details_23878.html; Package: 0603; Supplier: LC; SuppliersPartNumber: C23151; Resistance: 390Ω; Tolerance: 1%
R17 = 0402 220R (2200) 1%: Chip resistor; Manufacturer: Uniroyal Elec; PartNumber: 0402WGF2200TCE; Power: 1/16W; ComponentLink1Description: Supplier link; ComponentLink1URL: http://www.szlcsc.com/product/details_25834.html; Package: 0402; Supplier: LC; SuppliersPartNumber: C25091; Resistance: 220Ω; Tolerance: 1%
VR1 = SOT-223 AMS1117-3.3: 低压差线性稳压(LDO); ComponentLink1Description: 供应商链接; ComponentLink1URL: http://www.szlcsc.com/product/details_6652.html; Package: SOT-223; Supplier: LC; SuppliersPartNumber: C6186

## Sheet DebuggerConnectors.SchDoc
size A4
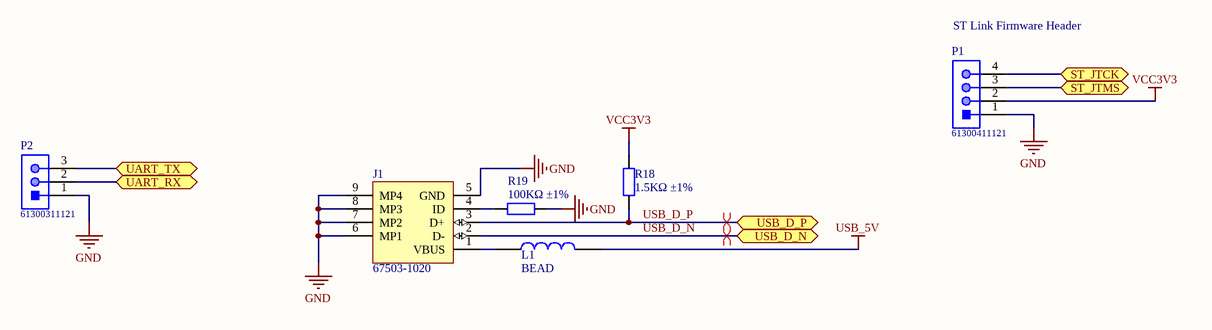
[diagram p6: DebuggerConnectors.SchDoc]

### Parts
J1  67503-1020  [MOLX-67503-1020_V]
L1  BEAD  [0603_L]
P1  61300411121  [61300411121]
P2  61300311121  [61300311121]
R18  1.5KΩ ±1%  [0402_R]
R19  100KΩ ±1%  [0402_R]

### Ports
ST_JTCK (bidir), ST_JTMS (bidir), UART_RX (bidir), UART_TX (bidir), USB_D_N (bidir), USB_D_P (bidir)

### Nets
GND: J1.5(GND) J1.6(MP1) J1.7(MP2) J1.8(MP3) J1.9(MP4) P1.1 P2.1 R19.2
USB_5V: L1.2
VCC3V3: P1.2 R18.2
ST_JTCK: P1.4 ; port ST_JTCK
ST_JTMS: P1.3 ; port ST_JTMS
USB_D_N: J1.2(D-) ; port USB_D_N
USB_D_P: J1.3(D+) R18.1 ; port USB_D_P
NetJ1_1: J1.1(VBUS) L1.1
NetJ1_4: J1.4(ID) R19.1
NetP2_2: P2.2 ; port UART_RX
NetP2_3: P2.3 ; port UART_TX

### Layout directives
differential pair: USB_D_N, USB_D_P

### Notes on the sheet
- (near P1) ST Link Firmware Header

### Library data of the parts
J1 = CMP-0411-00002-1: USB, MINI, SMD, RA KME04-USBMU03A01; Manufacturer: Molex; ComponentLink1URL: http://www.molex.com/; PartNumber: 67503-1020; Mounting Technology: Surface Mount; ComponentLink1Description: Manufacturer URL; Terminal Pitch: 0.8 mm; DatasheetVersion: Rev F, 06/2009; ComponentLink2Description: Datasheet; PackageDescription: Mini USB Connector, SMT, Righer Angle; ComponentLink2URL: http://www.molex.com/pdm_docs/sd/675031020_sd.pdf; PackageReference: 67503-1020
L1 = 0603 100R@100Mhz 1A: Ferrite Bead; Notepad: *; Package: 0603; Supplier: LC; SuppliersPartNumber: C64181
P1 = CMP-1502-01064-1: THT Vertical Pin Header WR-PHD, Pitch 2.54 mm, Single Row, 4 pins; Manufacturer: Wurth Elektronik; Withstanding Voltage: 500VAC; Rated Current: 3A; Working Voltage: 250VAC; Pin Number: 4; Gender: Male; Contact Resistance: 20mOhm; Pitch: 2.54mm; Manufacturer URL: http://www.we-online.de; Operating Temperature: -40to105degC; Packaging: Bag; Mounting Technology: THT; Package Reference: 61300411121; Datasheet URL: https://katalog.we-online.de/em/datasheet/6130xx11121.pdf; Publisher: WurthElektronik; Part Number: 61300411121; Row Number: Single; Orientation: Vertical
P2 = CMP-1502-01062-1: THT Vertical Pin Header WR-PHD, Pitch 2.54 mm, Single Row, 3 pins; Manufacturer: Wurth Elektronik; Withstanding Voltage: 500VAC; Working Voltage: 250VAC; Rated Current: 3A; Pitch: 2.54mm; Pin Number: 3; Gender: Male; Contact Resistance: 20mOhm; Package Reference: 61300311121; Manufacturer URL: http://www.we-online.de; Datasheet URL: https://katalog.we-online.de/em/datasheet/6130xx11121.pdf; Operating Temperature: -40to105degC; Part Number: 61300311121; Orientation: Vertical; Packaging: Bag; Row Number: Single; Mounting Technology: THT; Publisher: WurthElektronik
R18 = 0402 1.5K (1501) 1%: Chip resistor; Manufacturer: Uniroyal Elec; PartNumber: 0402WGF1501TCE; Power: 1/16W; ComponentLink1Description: Supplier link; ComponentLink1URL: http://www.szlcsc.com/product/details_26610.html; Package: 0402; Supplier: LC; SuppliersPartNumber: C25867; Resistance: 1.5KΩ; Tolerance: 1%
R19 = 0402 100K (1003) 1%: as R25 on sheet 12_TO_3V3_VOLTAGE_DIVIDER; ComponentLink1Description: Supplier link; ComponentLink1URL: http://www.szlcsc.com/product/details_26484.html; Package: 0402; Supplier: LC; SuppliersPartNumber: C25741; Resistance: 100KΩ; Tolerance: 1%

## Sheet 12V_POWER_BULKHEAD.SchDoc
size A4
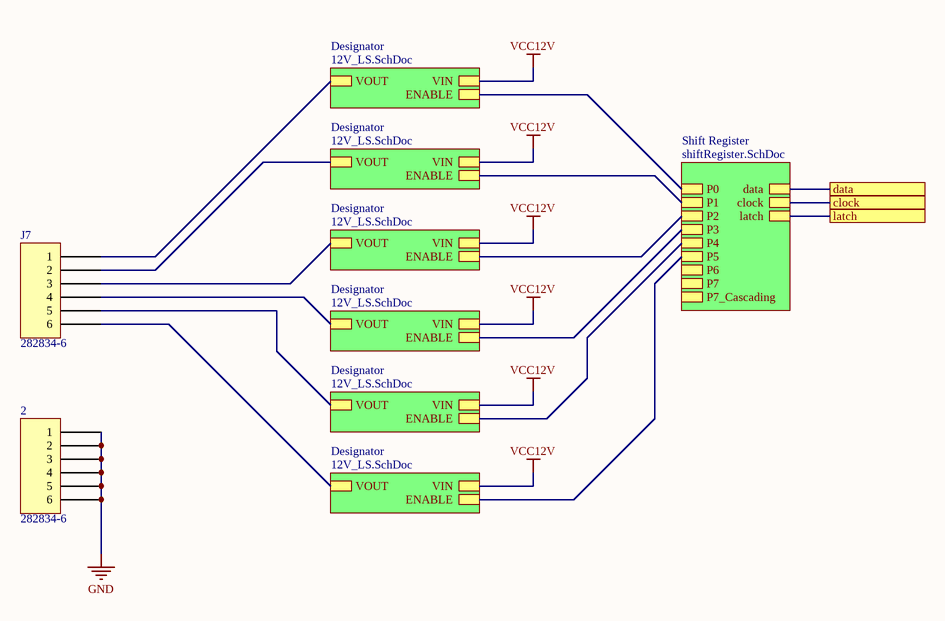
[diagram p7: 12V_POWER_BULKHEAD.SchDoc]

### Parts
2  282834-6  [TE 282834-6]
J7  282834-6  [TE 282834-6]

### Sub-sheets
Designator = 12V_LS.SchDoc: VOUT, ENABLE, VIN
Designator = 12V_LS.SchDoc: VOUT, ENABLE, VIN
Designator = 12V_LS.SchDoc: VOUT, ENABLE, VIN
Designator = 12V_LS.SchDoc: VOUT, ENABLE, VIN
Designator = 12V_LS.SchDoc: VOUT, ENABLE, VIN
Designator = 12V_LS.SchDoc: VOUT, ENABLE, VIN
Shift Register = shiftRegister.SchDoc: P0, P1, P2, P3, P4, P5, P6, P7, P7_Cascading, data, clock, latch

### Ports
clock, data, latch

### Nets
GND: 2.1 2.2 2.3 2.4 2.5 2.6
VCC12V: sheet Designator/VIN, sheet Designator/VIN, sheet Designator/VIN, sheet Designator/VIN, sheet Designator/VIN, sheet Designator/VIN
12V_CLOCK: port clock, sheet Shift Register/clock
12V_DATA: port data, sheet Shift Register/data
12V_LATCH: port latch, sheet Shift Register/latch
NetJ7_1: J7.1 ; sheet Designator/VOUT
NetJ7_2: J7.2 ; sheet Designator/VOUT
NetJ7_3: J7.3 ; sheet Designator/VOUT
NetJ7_4: J7.4 ; sheet Designator/VOUT
NetJ7_5: J7.5 ; sheet Designator/VOUT
NetJ7_6: J7.6 ; sheet Designator/VOUT
NetU4_12V_Power_And_Ground_Shift_Register_1: sheet Shift Register/P1, sheet Designator/ENABLE
NetU4_12V_Power_And_Ground_Shift_Register_2: sheet Shift Register/P2, sheet Designator/ENABLE
NetU4_12V_Power_And_Ground_Shift_Register_3: sheet Shift Register/P3, sheet Designator/ENABLE
NetU4_12V_Power_And_Ground_Shift_Register_4: sheet Shift Register/P4, sheet Designator/ENABLE
NetU4_12V_Power_And_Ground_Shift_Register_5: sheet Shift Register/P5, sheet Designator/ENABLE
NetU4_12V_Power_And_Ground_Shift_Register_15: sheet Shift Register/P0, sheet Designator/ENABLE

### Library data of the parts
2 J7 = 282834-6: TERM BLK 6P SIDE ENT 2.54MM PCB; Manufacturer: TE Connectivity AMP Connectors; Current: 10A; Mating Orientation: Horizontal with Board; Number of Levels: 1; Pitch: 0.100" (2.54mm); Positions Per Level: 6; Voltage: 150V; Wire Gauge: 16-30 AWG; Wire Termination: Screw - Rising Cage Clamp; Part Number: 282834-6; Color: Green; ComponentLink1Description: Datasheet; ComponentLink1URL: https://www.te.com/commerce/DocumentDelivery/DDEController?Action=srchrtrv&DocNm=282834&DocType=Customer+Drawing&DocLang=English; ComponentLink2Description: DigiKey Link; ComponentLink2URL: http://digikey.com/product-detail/en/te-connectivity-amp-connectors/282834-6/A98337-ND/1153267; LastUpdated: 2020-01-15 4:16:31 AM; Lifecycle Status: Active; Minimum Order: 1; Mounting Type: Through Hole; Packaging: Bulk; Part Status: Active; Price: 4.72; Series: Buchanan; Supplier 1: DigiKey; Supplier Part Number 1: A98337-ND

## Sheet shiftRegister.SchDoc
size A4
Used 2 times, as channels 12V Power And Ground/Shift Register, Shift Register. Parts and nets are listed once, with the designators drawn on the sheet.
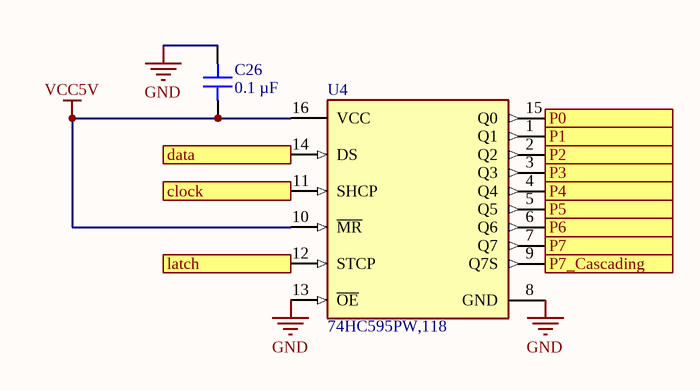
[diagram p8: shiftRegister.SchDoc]

### Parts
C26  0.1 µF  [CAP 0603_1608]
U4  74HC595PW,118  [FP-SOT403-1-MFG]

### Ports
clock, data, latch, P0, P1, P2, P3, P4, P5, P6, P7, P7_Cascading

### Nets
GND: C26.2 U4.8(GND) U4.13(~{OE})
VCC5V: C26.1 U4.10(~{MR}) U4.16(VCC)
clock: U4.11(SHCP) ; port clock
data: U4.14(DS) ; port data
latch: U4.12(STCP) ; port latch
P0: U4.15(Q0) ; port P0
P1: U4.1(Q1) ; port P1
P2: U4.2(Q2) ; port P2
P3: U4.3(Q3) ; port P3
P4: U4.4(Q4) ; port P4
P5: U4.5(Q5) ; port P5
P6: U4.6(Q6) ; port P6
P7: U4.7(Q7) ; port P7
P7_Cascading: U4.9(Q7S) ; port P7_Cascading

### Channels
12V Power And Ground/Shift Register: designators end in _12V_Power_And_Ground_Shift_Register; ports clock=12V_CLOCK data=12V_DATA latch=12V_LATCH P0=NetU4_12V_Power_And_Ground_Shift_Register_15 P1=NetU4_12V_Power_And_Ground_Shift_Register_1 P2=NetU4_12V_Power_And_Ground_Shift_Register_2 P3=NetU4_12V_Power_And_Ground_Shift_Register_3 P4=NetU4_12V_Power_And_Ground_Shift_Register_4 P5=NetU4_12V_Power_And_Ground_Shift_Register_5 P6=NetU4_12V_Power_And_Ground_Shift_Register_6 P7=NetU4_12V_Power_And_Ground_Shift_Register_7 P7_Cascading=NetU4_12V_Power_And_Ground_Shift_Register_9
Shift Register: designators C26=C26_Shift_Register U4=U4; ports clock=NetU4_11 data=NetU4_14 latch=NetU4_12 P0=NetIC2_5VLS1_3 P1=NetIC2_5VLS2_3 P2=NetIC2_5VLS3_3 P3=NetIC2_5VLS4_3 P4=NetIC2_5VLS5_3 P5=NetIC2_5VLS6_3 P6=NetU4_6 P7=NetU4_7 P7_Cascading=NetU4_9

### Library data of the parts
C26 = C0603C104K5RAC7411: CAP CER 0.1UF 50V X7R 0603; manufacturer: KEMET; Tolerance: ±10%; Part Number: C0603C104K5RAC7411; Value: 0.1 µF; Applications: Bypass, Decoupling; Capacitance: 0.1 µF; componentlink1description: Datasheet; componentlink1url: https://api.kemet.com/component-edge/download/datasheet/C0603C104K5RAC7411.pdf; componentlink2description: DigiKey Link; componentlink2url: https://www.digikey.com/en/products/detail/kemet/C0603C104K5RAC7411/3317013; Device Package: 0603 (1608 Metric); lastupdated: 2023-06-20 7:12:54 PM; Lifecycle Status: Active; Minimum Order: 1; Mounting Type: Surface Mount, MLCC; Operating Temperature: -55°C ~ 125°C; Package / Case: 0603 (1608 Metric); packaging: TapeAndReel; partid: 2233; Part Status: Active; price: 0.01; series: SMD Comm X7R; Size / Dimension: 0.063" L x 0.031" W (1.60mm x 0.80mm); Supplier 1: DigiKey; Supplier Part Number 1: 399-C0603C104K5RAC7411CT-ND; Temperature Coefficient: X7R; Thickness (Max): 0.035" (0.90mm); Voltage - Rated: 50V
U4 = CMP-14351-000004-1: IC SHIFT REGISTER 8BIT 16TSSOP

## Sheet 12V_LS.SchDoc
size A4
Used 6 times, as channels 12V Power And Ground/Designator, 12V Power And Ground/Designator, 12V Power And Ground/Designator, 12V Power And Ground/Designator, 12V Power And Ground/Designator, 12V Power And Ground/Designator. Parts and nets are listed once, with the designators drawn on the sheet.

### Channels
12V Power And Ground/Designator: no parts or ports
12V Power And Ground/Designator: no parts or ports
12V Power And Ground/Designator: no parts or ports
12V Power And Ground/Designator: no parts or ports
12V Power And Ground/Designator: no parts or ports
12V Power And Ground/Designator: no parts or ports

## Sheet Connectors.SchDoc
size A4
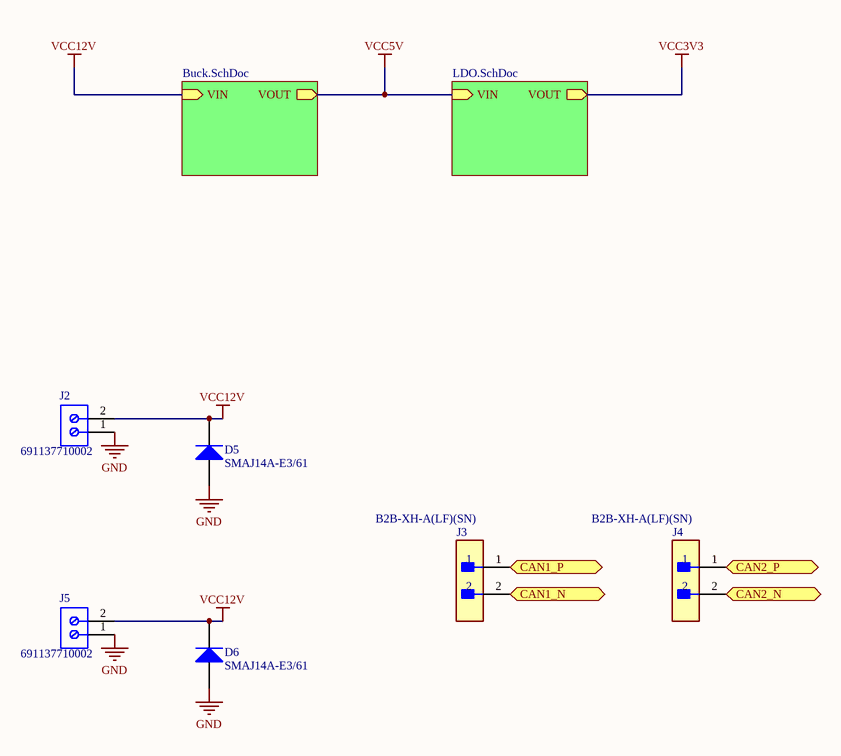
[diagram p9: Connectors.SchDoc]

### Parts
D5  SMAJ14A-E3/61  [VISH-DO-214AC-2_L]
D6  SMAJ14A-E3/61  [VISH-DO-214AC-2_L]
J2  691137710002  [691137710002]
J3  B2B-XH-A(LF)(SN)  [FP-B2B-XH-A_LF_SN-MFG]
J4  B2B-XH-A(LF)(SN)  [FP-B2B-XH-A_LF_SN-MFG]
J5  691137710002  [691137710002]

### Sub-sheets
Buck = Buck.SchDoc: VIN (in), VOUT (out)
LDO = LDO.SchDoc: VIN (in), VOUT (out)

### Ports
CAN1_N (bidir), CAN1_P (bidir), CAN2_N (bidir), CAN2_P (bidir)

### Nets
GND: D5.2(A) D6.2(A) J2.1 J5.1
VCC5V: sheet Buck/VOUT, sheet LDO/VIN
VCC12V: D5.1(K) D6.1(K) J2.2 J5.2 ; sheet Buck/VIN
NetJ3_1: J3.1 ; port CAN1_P
NetJ3_2: J3.2 ; port CAN1_N
NetJ4_1: J4.1 ; port CAN2_P
NetJ4_2: J4.2 ; port CAN2_N

### Library data of the parts
D5 D6 = CMP-0548-00224-2: Transient Voltage Suppressor, 6.40 to 231 V, 14 V Stand-off Voltage, Uni-Directional, -55 to 155 degC, 2-pin DO-214AC, Pb-Free, Tape and Reel; Manufacturer: Vishay Semiconductor; PPPM (W): 400, 300; VWM (V): 14; VBR Uni-Directional (V): 6.4 to 231; IFSM: 40 A; ID (uA): 1; PackageDescription: 2-Pin DO-214AC (SMA), Body 4.245 x 2.665 mm; ComponentLink2URL: http://www.vishay.com/docs/88390/smaj50a.pdf; Mounting Technology: Surface Mount; PartNumber: SMAJ14A-E3/61; Operating Junction and Storage Temperature Range: -55 to 150 degC; ComponentLink2Description: Datasheet; Packing: Tape and Reel; PackageReference: DO-214AC-2; ComponentLink3Description: Package Specification; ComponentLink1URL: http://www.vishay.com/; RoHS: TRUE; ComponentLink3URL: http://www.vishay.com/docs/88390/smaj50a.pdf; ComponentLink1Description: Manufacturer URL; DatasheetVersion: 12/8/2013
J2 J5 = CMP-1502-03324-2: NexarPartId: 78871135; Voltage Rating: 300V; Number of Contacts: 2; Current Rating: 16A; Lead Pitch: 5mm; Height: 11.6mm; Packaging: Box; RoHS: Non-Compliant; Contact Material: Nickel, Tin; Max Operating Temperature: 120°C; Number of Pins: 2; Min Operating Temperature: -30°C; Number of Rows: 1
J3 J4 = CMP-2000-05888-3: CONN HEADER VERT 2POS 2.5MM; Current Rating: 3A; Voltage Rating: 250V; Number of Contacts: 2; Contact Resistance: 20mR; Wire/Cable Gauge: 22AWG; Insulation Resistance: 1GR; Connector Type: Male Pin; Packaging: Bulk; Contact Material: Brass; Lead Free: Lead Free; Orientation: Straight; Contact Plating: Tin; Max Current Rating: 3A; Termination: Solder; Fastening Type: Detent; Depth: 5.75mm; Housing Material: Polyamide; REACH SVHC: No SVHC; Series: XH; Voltage Rating (AC): 250V; Number of Positions: 2; Color: Natural; Contact Type: Male Pin; Max Voltage Rating (DC): 250V; Pitch: 2.5mm; Lead Pitch: 2.5mm; Mount: Through Hole; Max Operating Temperature: 85°C; Length: 7.4mm; Max Voltage Rating (AC): 250V; Min Operating Temperature: -25°C; Number of Rows: 1; Housing Color: White

## Sheet Buck.SchDoc
size A4
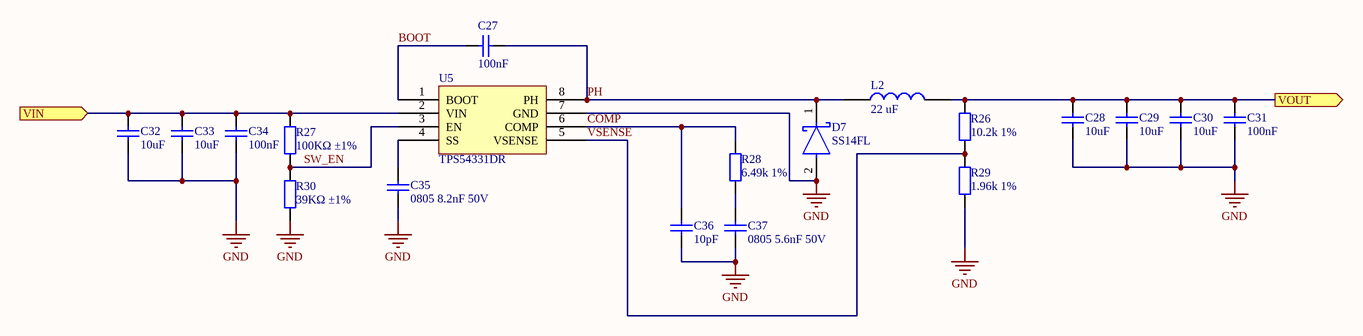
[diagram p10: Buck.SchDoc]

### Parts
C27  100nF  [0603_C]
C28  10uF  [0603_C]
C29  10uF  [0603_C]
C30  10uF  [0603_C]
C31  100nF  [0603_C]
C32  10uF  [0805_C]
C33  10uF  [0805_C]
C34  100nF  [0603_C]
C35  0805 8.2nF 50V  [0805_C]
C36  10pF  [0603_C]
C37  0805 5.6nF 50V  [0805_C]
D7  SS14FL  [FP-425AD-MFG]
L2  22 uF  [COBU-DR74-4R7-R_V]
R26  10.2k 1%  [1206_R]
R27  100KΩ ±1%  [0805_R]
R28  6.49k 1%  [0805_R]
R29  1.96k 1%  [1206_R]
R30  39KΩ ±1%  [0805_R]
U5  TPS54331DR  [SOIC-8_150mil]

### Ports
VIN (in), VOUT (out)

### Nets
GND: C28.1 C29.1 C30.1 C31.1 C32.1 C33.1 C34.1 C35.1 C36.1 C37.1 D7.2(A) R29.1 R30.1 U5.7(GND)
VCC5V: C28.2 C29.2 C30.2 C31.2 L2.2 R26.1 ; port VOUT
VCC12V: C32.2 C33.2 C34.2 R27.1 U5.2(VIN) ; port VIN
BOOT: C27.2 U5.1(BOOT)
COMP: C36.2 R28.2 U5.6(COMP)
PH: C27.1 D7.1(C) L2.1 U5.8(PH)
SW_EN: R27.2 R30.2 U5.3(EN)
VSENSE: R26.2 R29.2 U5.5(VSENSE)
NetC35_2: C35.2 U5.4(SS)
NetC37_2: C37.2 R28.1

### Library data of the parts
C27 C31 C34 = 0603 100nF (104) 10% 50V: Chip capacitors; Manufacturer: YAGEO; PartNumber: CC0603KRX7R9BB104; Tolerance: 10%; Voltage: 50V; ComponentLink1Description: Supplier link; ComponentLink1URL: http://www.szlcsc.com/product/details_15331.html; Package: 0603; Supplier: LC; SuppliersPartNumber: C14663; Capacitance: 100nF
C28-C30 = 0603 10uF (106) 10% 10V: Chip capacitors; Manufacturer: Samsung Electro-Mechanics; PartNumber: CL10A106KP8NNNC; Tolerance: 10%; Voltage: 10V; ComponentLink1Description: Supplier link; ComponentLink1URL: http://www.szlcsc.com/product/details_20411.html; Package: 0603; Supplier: LC; SuppliersPartNumber: C19702; Capacitance: 10uF
C32 C33 = 0805 10uF (106) 10% 25V: Chip capacitors; Manufacturer: Samsung Electro-Mechanics; PartNumber: CL21A106KAYNNNE; Tolerance: 10%; Voltage: 25V; ComponentLink1Description: Supplier link; ComponentLink1URL: http://www.szlcsc.com/product/details_16532.html; Package: 0805; Supplier: LC; SuppliersPartNumber: C15850; Capacitance: 10uF
C35 = 0805 8.2nF 50V: PartNumber: CL21B822KBANNNC; LCSC: C170117
C36 = 0603 10pF (100) 5% 50V: Chip capacitors; Manufacturer: Samsung Electro-Mechanics; PartNumber: CL10C100JB8NNNC; Tolerance: 5%; Voltage: 50V; ComponentLink1Description: Supplier link; ComponentLink1URL: http://www.szlcsc.com/product/details_1986.html; Package: 0603; Supplier: LC; SuppliersPartNumber: C1634; Capacitance: 10pF
C37 = 0805 5.6nF 50V: PartNumber: CL21B562KBANNNC; LCSC: C153719
D7 = CMP-07162-000013-1: DIODE SCHOTTKY 40V 1A SOD123F; Manufacturer: ON Semiconductor; Max Junction Temp: +125°C; Value: 60pF; Max Surge Forward Current: 40A; Peak Reverse Current: 30uA; Device Class L3: Schottky Diodes; Reverse Voltage: 40V; Automotive: No; Temperature: -55°C to +125°C; Mouser Description: SS14FL Series 40 V 1 A Surface Mount Schottky Barrier Rectifier - SOD-123F; Octopart: https://octopart.com/ss14fl-on+semiconductor-84331601; Height: 1.08mm; Temperature Range Low: -55°C; Category: Diode; Lead Free: Yes; Device Class L1: Discrete Semiconductors; Digikey Description: DIODE SCHOTTKY 40V 1A SOD123F; RoHS: TRUE; ComponentLink2Description: Datasheet; Manufacturer Part Number: SS14FL; Forward Current: 1A; Capacitance: 60pF; Package: 425AD; Device Class L2: Diodes; Temperature Range High: +125°C; Max Repetitive Reverse Voltage: 40V; ComponentLink2URL: https://www.onsemi.com/pub/Collateral/SS14FL-D.PDF
L2 = SRP6540-5R6M
R26 = 1206 10.2k 1%: PartNumber: 1206W4F1022T5E; LCSC: C247410
R27 = 0805 100K (1003) 1%: Chip resistor; Manufacturer: Uniroyal Elec; Power: 1/8W; ComponentLink1Description: Supplier link; ComponentLink1URL: http://www.szlcsc.com/product/details_18095.html; Package: 0805; Supplier: LC; SuppliersPartNumber: C17407; Tolerance: 1%
R28 = 0805 6.49k 1%: PartNumber: 0805W8F6491T5E; LCSC: C17769
R29 = 1206 1.96k 1%: PartNumber: 1206W4F1022T5E; LCSC: C247410
R30 = 0805 39K (3902) 1%: Chip resistor; Manufacturer: Uniroyal Elec; Power: 1/8W; ComponentLink1Description: Supplier link; ComponentLink1URL: http://www.szlcsc.com/product/details_26569.html; Package: 0805; Supplier: LC; SuppliersPartNumber: C25826; Tolerance: 1%
U5 = TPS54331DR_[C9865]: DC-DC芯片; ComponentLink1Description: 供应商链接; ComponentLink1URL: http://www.szlcsc.com/product/details_10397.html; Package: SOIC-8_150mil; Supplier: LC; SuppliersPartNumber: C9865

## Sheet LDO.SchDoc
size A4

## Sheet CAN.SchDoc
size A4
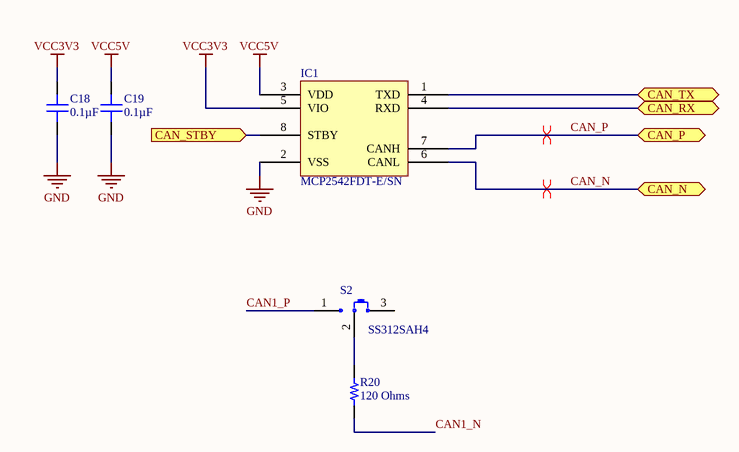
[diagram p11: CAN.SchDoc]

### Parts
C18  0.1µF  [CAP 0201_0603]
C19  0.1µF  [CAP 0201_0603]
IC1  MCP2542FDT-E/SN  [MICROCHIP SOIC-8 150MIL WIDE]
R20  120 Ohms  [RES 0402_1005]
S2  SS312SAH4  [NKK SS312SAH4]

### Ports
CAN_N (bidir), CAN_P (bidir), CAN_RX (bidir), CAN_STBY (in), CAN_TX (bidir)

### Nets
GND: C18.1 C19.1 IC1.2(VSS)
VCC3V3: C18.2 IC1.5(VIO)
VCC5V: C19.2 IC1.3(VDD)
CAN1_N: R20.1
CAN1_P: S2.1
CAN_N: IC1.6(CANL) ; port CAN_N
CAN_P: IC1.7(CANH) ; port CAN_P
NetIC1_1: IC1.1(TXD) ; port CAN_TX
NetIC1_4: IC1.4(RXD) ; port CAN_RX
NetIC1_8: IC1.8(STBY) ; port CAN_STBY
NetR20_2: R20.2 S2.2(COM)

Not connected (* = marked no-connect by the designer): S2 3

### Layout directives
differential pair: CAN_N, CAN_P

### Library data of the parts
C18 C19 = EMK063BJ104KP-F: CAP CER 0.1UF 16V X5R 0201; Manufacturer: Taiyo Yuden; Tolerance: ±10%; Part Number: EMK063BJ104KP-F; Value: 0.1µF; Applications: General Purpose; Capacitance: 0.1µF; ComponentLink1Description: Datasheet; ComponentLink1URL: https://ds.yuden.co.jp/TYCOMPAS/ut/detail?pn=EMK063BJ104KP-F  &u=M; ComponentLink2Description: DigiKey Link; ComponentLink2URL: http://digikey.com/product-detail/en/taiyo-yuden/EMK063BJ104KP-F/587-5833-1-ND/7674954; Device Package: 0201 (0603 Metric); LastUpdated: 2020-09-02 1:00:18 AM; Lifecycle Status: Active; Minimum Order: 1; Mounting Type: Surface Mount, MLCC; Operating Temperature: -55°C ~ 85°C; Package / Case: 0201 (0603 Metric); Packaging: TapeAndReel; PartId: 12; Part Status: Active; Price: 0.02; Series: M; Size / Dimension: 0.024" L x 0.012" W (0.60mm x 0.30mm); Supplier 1: DigiKey; Supplier Part Number 1: 587-5833-1-ND; Temperature Coefficient: X5R; Thickness (Max): 0.013" (0.33mm); Voltage - Rated: 16V
IC1 = MCP2542FDT-E/SN: IC TRANSCEIVER 1/1 8SOIC; Manufacturer: Microchip Technology; Data Rate: 8Mbps; Protocol: CANbus; Receiver Hysteresis: 200mV; Voltage - Supply: 4.5V ~ 5.5V; Part Number: MCP2542FDT-E/SN; ComponentLink1Description: Datasheet; ComponentLink1URL: http://www.microchip.com/mymicrochip/filehandler.aspx?ddocname=en585412; ComponentLink2Description: DigiKey Link; ComponentLink2URL: http://digikey.com/product-detail/en/microchip-technology/MCP2542FDT-E-SN/MCP2542FDT-E-SNCT-ND/9642863; Device Package: 8-SOIC (0.154", 3.90mm Width); LastUpdated: 2020-05-24 11:07:13 PM; Lifecycle Status: Active; Minimum Order: 1; Mounting Type: Surface Mount; Number of Drivers/Receivers: 1/1; Operating Temperature: -40°C ~ 125°C; Package / Case: 8-SOIC (0.154", 3.90mm Width); Packaging: TapeAndReel; Part Status: Active; Price: 0.59; Series: -; Supplier 1: DigiKey; Supplier Part Number 1: MCP2542FDT-E/SNCT-ND; Supplier Device Package: 8-SOIC; Type: Transceiver
R20 = RC0402JR-07120RL: RES SMD 120 OHM 5% 1/16W 0402; Manufacturer: Yageo; Power (Watts): 0.063W, 1/16W; Temperature Coefficient: ±100ppm/°C; Part Number: RC0402JR-07120RL; Value: 120 Ohms; ComponentLink1Description: Datasheet; ComponentLink1URL: https://www.yageo.com/upload/media/product/productsearch/datasheet/rchip/PYu-RC_Group_51_RoHS_L_10.pdf; ComponentLink2Description: DigiKey Link; ComponentLink2URL: http://digikey.com/product-detail/en/yageo/RC0402JR-07120RL/311-120JRCT-ND/2827967; Composition: Thick Film; Device Package: 0402 (1005 Metric); Features: Moisture Resistant; Height - Seated (Max): 0.016" (0.40mm); LastUpdated: 2020-09-02 1:08:05 AM; Lifecycle Status: Active; Minimum Order: 1; Number of Terminations: 2; Operating Temperature: -55°C ~ 155°C; Package / Case: 0402 (1005 Metric); Packaging: CutTape; PartId: 4797; Part Status: Active; Price: 0.10; Resistance: 120 Ohms; Series: RC; Size / Dimension: 0.039" L x 0.020" W (1.00mm x 0.50mm); Supplier 1: DigiKey; Supplier Part Number 1: 311-120JRCT-ND; Supplier Device Package: 0402; Tolerance: ±5%
S2 = SS312SAH4: SWITCH SLIDE SPDT 0.4VA 28V; Manufacturer: NKK Switches; Actuator Length: 2.00mm; Actuator Type: Standard; Contact Timing: Shorting (MBB); Current Rating (Amps): 0.4VA (AC/DC); Switch Function: On-On; Part Number: SS312SAH4; Circuit: SPDT; ComponentLink1Description: Datasheet; ComponentLink1URL: http://www.nkkswitches.com/pdf/SS3surfaceMount-1.pdf; ComponentLink2Description: DigiKey Link; ComponentLink2URL: http://digikey.com/product-detail/en/nkk-switches/SS312SAH4/360-3250-ND/1052031; Contact Finish: Gold; Contact Material: Phosphor Bronze; LastUpdated: 2020-01-04 7:15:23 PM; Lifecycle Status: Active; Minimum Order: 1; Mounting Type: Surface Mount, Right Angle; Operating Temperature: -25°C ~ 85°C; Packaging: Tray; PartId: 2; Part Status: Active; Price: 3.02; Series: SS3; Supplier 1: DigiKey; Supplier Part Number 1: 360-3250-ND; Termination Style: Gull Wing; Voltage Rating - AC: 28V; Voltage Rating - DC: 28V